# EasyEDA Pro project ZeptoWatch.eprj, schematic Schematic6
Create Date: 2022-12-24; Page Name: P1; Project Name: ZeptoWatch; Schematic Name: Schematic6; Update Date: 2022-12-24; Company: 嘉立创EDA; Page Size: A2; Version: V1.0
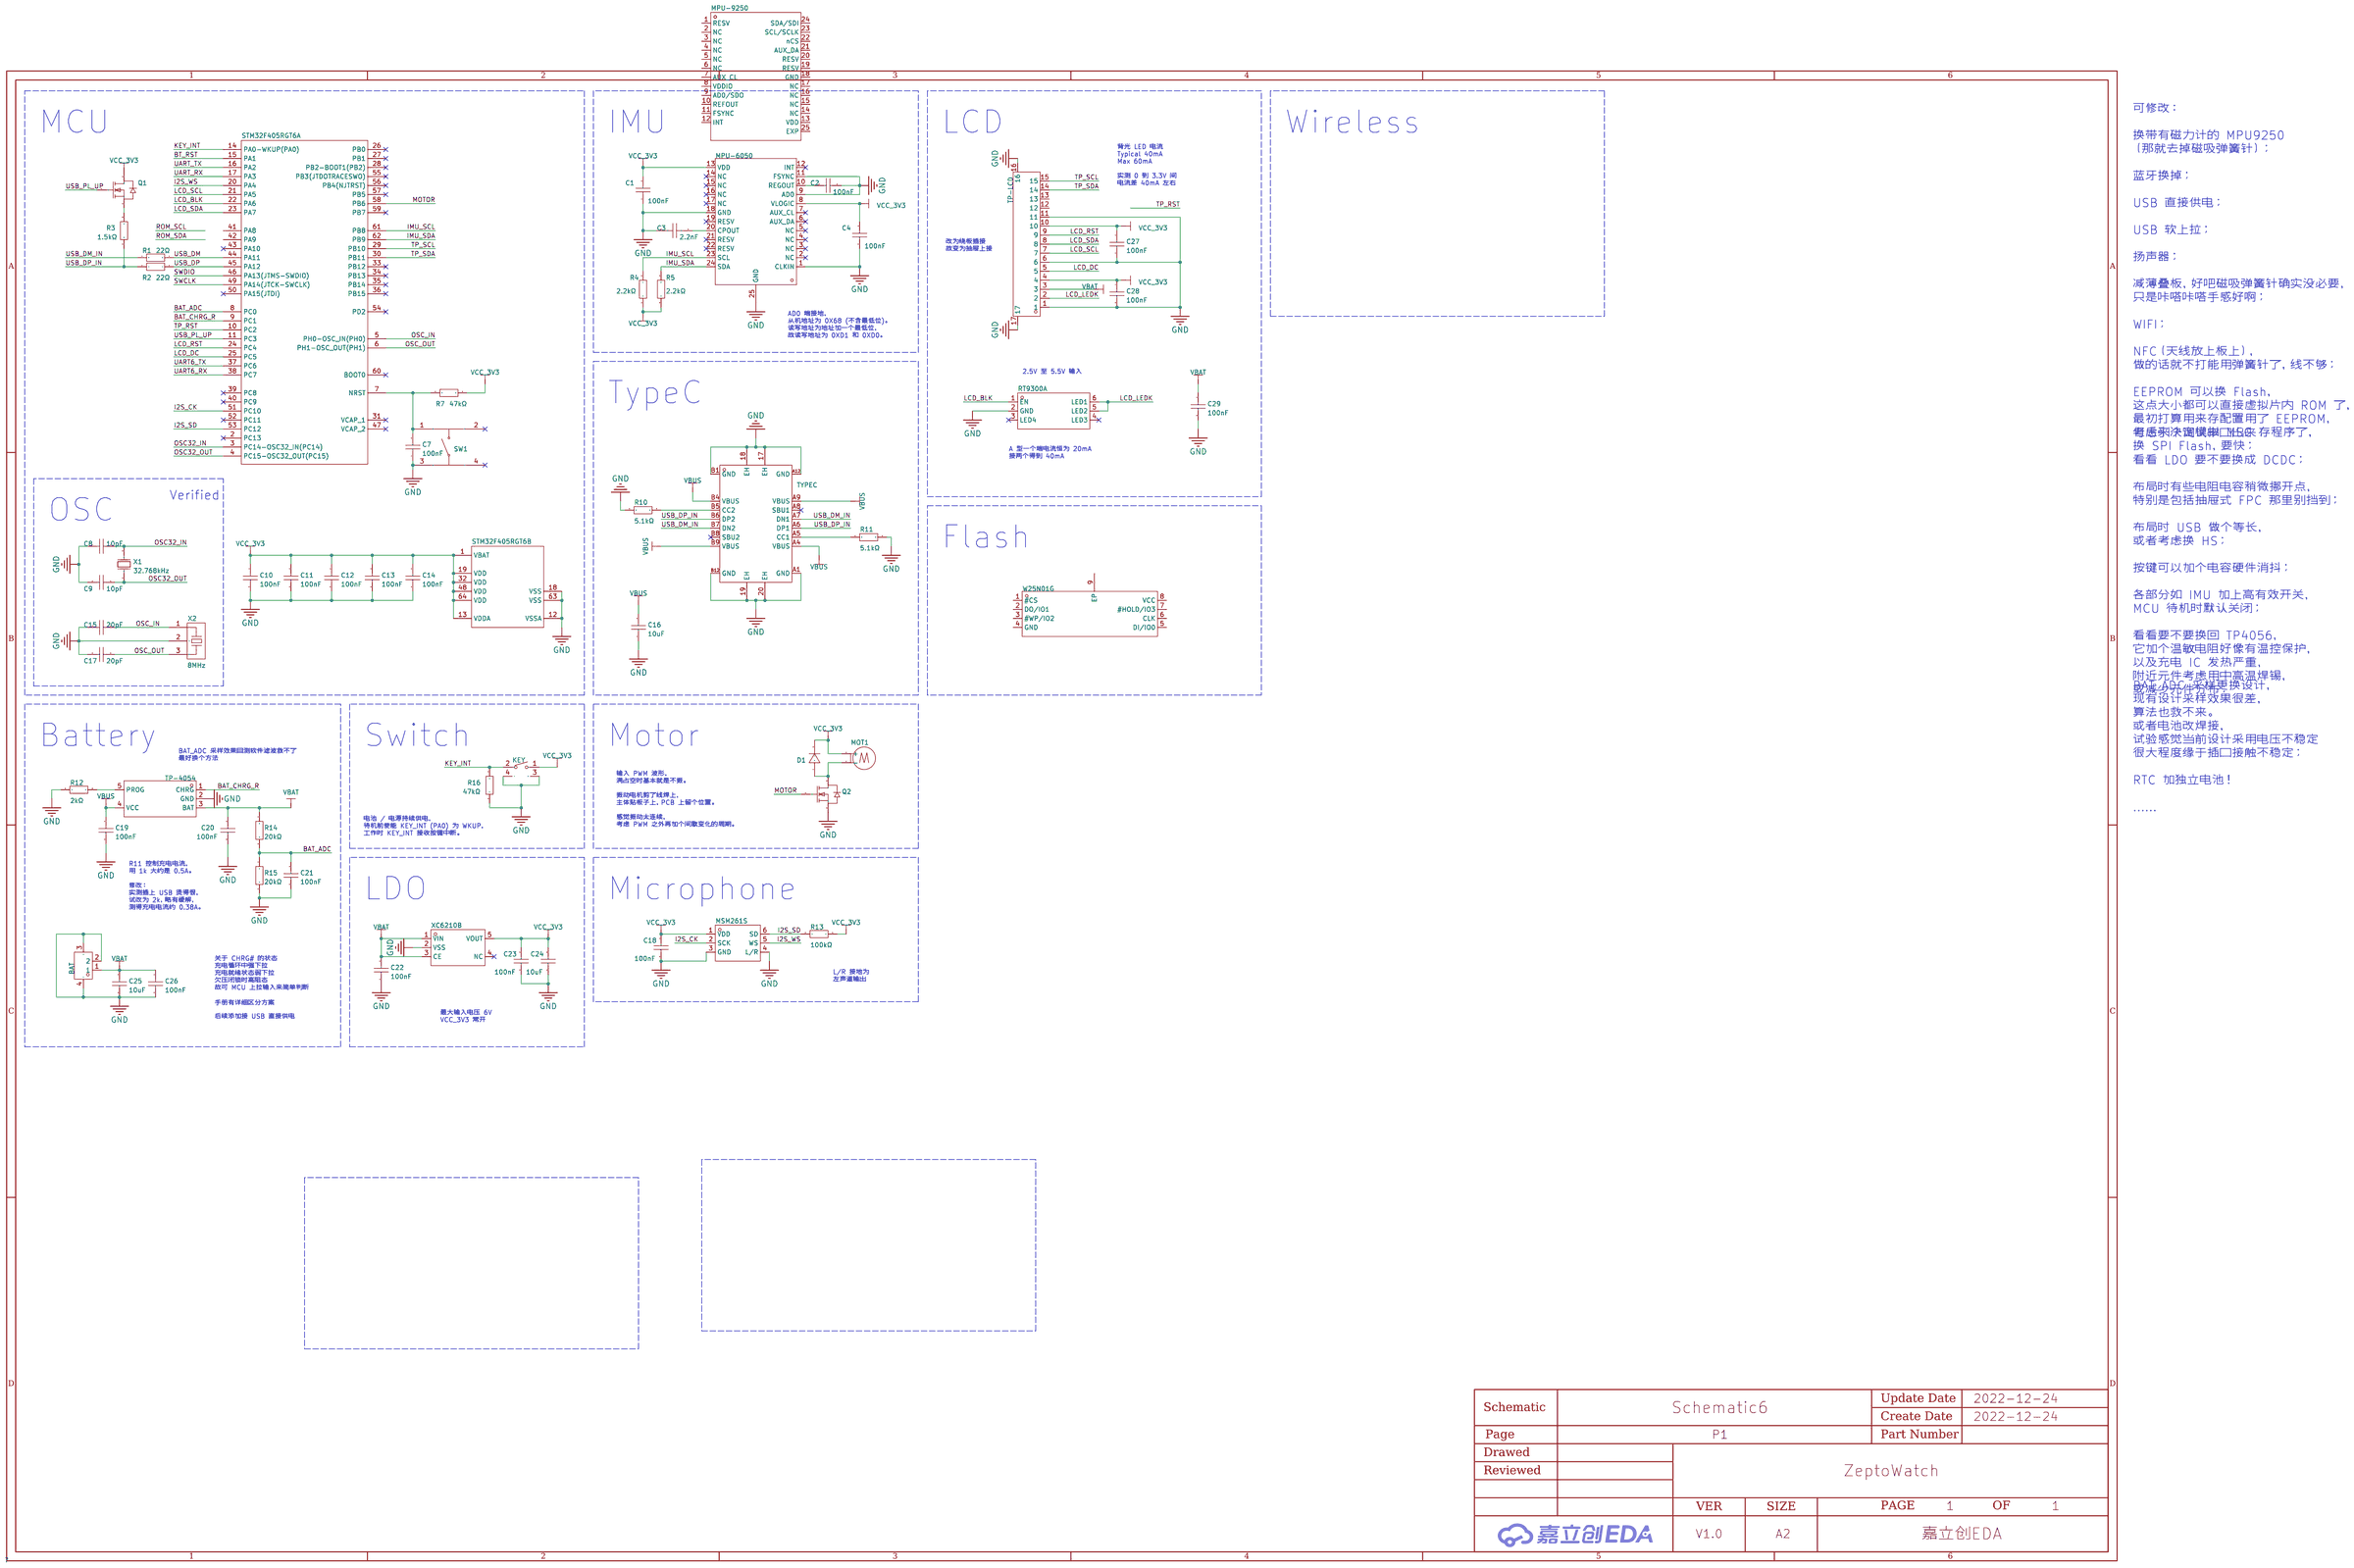
[diagram p5: schematic sheet]

## Parts
BAT  1.25K-CB-2PWB  [CONN-SMD_2P-P1.25_L5.5-W7.7-2PWB]
C1  100nF  [C0402]
C2  100nF  [C0402]
C3  2.2nF  [C0402]
C4  100nF  [C0402]
C7  100nF  [C0402]
C8  10pF  [C0402]
C9  10pF  [C0402]
C10  100nF  [C0402]
C11  100nF  [C0402]
C12  100nF  [C0402]
C13  100nF  [C0402]
C14  100nF  [C0402]
C15  20pF  [C0402]
C16  10uF  [C0402]
C17  20pF  [C0402]
C18  100nF  [C0402]
C19  100nF  [C0402]
C20  100nF  [C0402]
C21  100nF  [C0402]
C22  100nF  [C0402]
C23  100nF  [C0402]
C24  10uF  [C0402]
C25  10uF  [C0402]
C26  100nF  [C0402]
C27  100nF  [C0402]
C28  100nF  [C0402]
C29  100nF  [C0402]
D1  B5819WS  [SOD-323_L1.8-W1.3-LS2.5-FD]
KEY  TS-KG012EV  [SW-SMD_TS-KG012EV]
MOT1  LCM1027A2445F  [VIBRATING-MOTOR-SMD_WELDING]
MPU-6050  MPU-6050  [QFN-24_L4.0-W4.0-P0.50-BL-EP2.7]
MPU-9250  MPU-9250  [QFN-24_L3.0-W3.0-P0.40-BL-EP]
MSM261S  MSM261S3526Z0CM  [MIC-SMD_6P-L3.5-W2.7-P0.90-TR]
Q1  AO3400A  [SOT-23-3_L2.9-W1.6-P1.90-LS2.8-BR]
Q2  AO3400A  [SOT-23-3_L2.9-W1.6-P1.90-LS2.8-BR]
R1  22Ω  [R0402]
R2  22Ω  [R0402]
R3  1.5kΩ  [R0402]
R4  2.2kΩ  [R0402]
R5  2.2kΩ  [R0402]
R7  47kΩ  [R0402]
R10  5.1kΩ  [R0402]
R11  5.1kΩ  [R0402]
R12  2kΩ  [R0402]
R13  100kΩ  [R0402]
R14  20kΩ  [R0402]
R15  20kΩ  [R0402]
R16  47kΩ  [R0402]
RT9300A  -  [SOT-23-6_L2.9-W1.6-P0.95-LS2.8-BR]
STM32F405RGT6  STM32F405RGT6  [LQFP-64_L10.0-W10.0-P0.50-LS12.0-BL]  (sections 1,2)
SW1  TS-1127-C  [SW-SMD_4P-L4.5-W4.5-P3.00-LS6.0]
TP-4054  TP4054-42-SOT25R  [SOT-23-5_L3.0-W1.7-P0.95-LS2.8-BR]
TP-LCD  X05B20U15T  [FFC-SMD_15P-P0.50_X05B20U15T]
TYPEC  TYPE-C-16M-005  [USB-C-SMD_TYPE-C-16M-005]
W25N01G  W25N01GVZEIG  [WSON-8_L8.0-W6.10-P1.27-TL-EP]
X1  32.768kHz  [OSC-SMD_L3.2-W1.5]
X2  8MHz  [OSC-SMD_3P-L3.2-W1.3-P1.2-L]
XC6210B  XC6210B332MR  [SOT-25_L3.0-W1.6-P0.95-LS2.8-BL]

## Library data of the parts
BAT = 1.25K-CB-2PWB: 参考系列:-;间距:1.25mm;插针结构:1x2P;排数:1;每排PIN数:2;行距:-;公母:公型插针;安装方式:卧贴;额定电流:1A;工作温度范围:-25~+85;; LCSC Part Name: 1x2P 间距P=1.25mm 超薄针座 超薄; Supplier Part: C2919570; Manufacturer: HDGC(华德共创); Supplier Footprint: SMD,P=1.25mm; JLCPCB Part Class: 扩展库; Datasheet: https://atta.szlcsc.com/upload/public/pdf/source/20211115/F776F48743F73668B48ED2809AC4027A.pdf; Supplier: LCSC; Pitch: 1.25mm; Pins Structure: 1x2P; Number of Rows: 1; Number of PINs Per Row: 2; Gender: 公型插针; Mounting Style: 卧贴; Current Rating (Max): 1A; Operating Temperature Range: -25~+85
C1 C2 C4 C7 C10-C14 C18-C23 C26-C29 = CC0402KRX7R9BB104: 容值:100nF;精度:±10%;额定电压:50V;材质(温度系数):X7R;; LCSC Part Name: 100nF ±10% 50V; Supplier Part: C131394; Manufacturer: YAGEO(国巨); Supplier Footprint: 0402; JLCPCB Part Class: 扩展库; Datasheet: https://atta.szlcsc.com/upload/public/pdf/source/20170925/C131394_1506321459057990237.pdf; Supplier: LCSC; Tolerance: ±10%; Voltage Rated: 50V; Temperature Coefficient: X7R
C3 = CC0402JRX7R9BB222: 温度系数:X7R;容值:2.2nF;电容体长:-;电容体宽:-;电容体厚度:-;精度:±5%;额定电压:50V;; LCSC Part Name: 2.2nF ±5% 50V; Supplier Part: C513667; Manufacturer: YAGEO(国巨); Supplier Footprint: 0402; JLCPCB Part Class: 扩展库; Datasheet: https://atta.szlcsc.com/upload/public/pdf/source/20200415/C513667_43ACA5E3BCCDD816EC65E9B61132137F.pdf; Supplier: LCSC; Temperature Coefficient: X7R; Tolerance: ±5%; Voltage Rated: 50V
C8 C9 = 0402CG100J500NT: 容值:10pF;精度:±5%;额定电压:50V;材质(温度系数):C0G;; LCSC Part Name: 10pF ±5% 50V; Supplier Part: C1545; Manufacturer: FH(风华); Supplier Footprint: 0402; JLCPCB Part Class: 扩展库; Datasheet: https://atta.szlcsc.com/upload/public/pdf/source/20170923/C1545_1506149264855988352.pdf; Supplier: LCSC; Tolerance: ±5%; Voltage Rated: 50V; Temperature Coefficient: C0G
C15 C17 = 0402CG200J500NT: 温度系数:C0G;容值:20pF;精度:±5%;额定电压:50V;; LCSC Part Name: 20pF(200) ±5% 50V; Supplier Part: C1554; Manufacturer: FH(风华); Supplier Footprint: 0402; JLCPCB Part Class: 基础库; Datasheet: https://atta.szlcsc.com/upload/public/pdf/source/20170923/C1554_1506149268708988361.pdf; Supplier: LCSC; Temperature Coefficient: C0G; Tolerance: ±5%; Voltage Rated: 50V
C16 C24 C25 = CL05A106MQ5NUNC: 容值:10uF;精度:±20%;额定电压:6.3V;材质(温度系数):X5R;; LCSC Part Name: 10uF ±20% 6.3V; Supplier Part: C15525; Manufacturer: SAMSUNG(三星); Supplier Footprint: 0402; JLCPCB Part Class: 基础库; Datasheet: https://atta.szlcsc.com/upload/public/pdf/source/20220823/2B02EE04F8F211D38A52DCB16EB6BEBA.pdf; Supplier: LCSC; Tolerance: ±20%; Voltage Rated: 6.3V; Temperature Coefficient: X5R
D1 = B5819WS_C511873: 直流反向耐压(Vr):40V;平均整流电流(Io):1A;正向压降(Vf):900mV@3A;; LCSC Part Name: 40V 1A 900mV@3A; Supplier Part: C511873; Manufacturer: BORN伯恩半导体; Supplier Footprint: SOD-323; JLCPCB Part Class: 扩展库; Datasheet: https://atta.szlcsc.com/upload/public/pdf/source/20200413/C511871_84C991E4F87F9BC6B00A967897FF2061.pdf; Supplier: LCSC; Reverse Voltage (Vr): 40V; Average Rectified Current (Io): 1A; Forward Voltage (Vf@If): 900mV@3A
KEY = TS-KG012EV: 触点电流:50mA;额定电压(DC):12V;绝缘电阻:100MΩ;电路结构:单刀单掷;安装方式:卧插;按钮形状:矩形按钮;带灯:-;; LCSC Part Name: 轻触开关3*6*3.5侧按卧式 带柱; Supplier Part: C410363; Manufacturer: HANBO(汉博); Supplier Footprint: 插件,7.8x3.6x3.5mm; JLCPCB Part Class: 扩展库; Datasheet: https://atta.szlcsc.com/upload/public/pdf/source/20221110/2C1BC81D53AC7E4C4CC26C5BC87C8C3B.pdf; Supplier: LCSC; Contact Current: 50mA; Voltage Rating (DC): 12V; Insulation Resistance: 100MΩ; Circuit: 单刀单掷; Mounting Style: 卧插; Actuator Style: 矩形按钮
MOT1 = LCM1027A2445F: 类型:扁平振动马达;额定电压:3V;额定电流:80mA;额定转速:10000rpm;工作温度:-20~+60;旋转方向:CW；CCW;; LCSC Part Name: 扁平1027 振动马达; Supplier Part: C2759984; Manufacturer: LEADER(立得); JLCPCB Part Class: 扩展库; Datasheet: https://atta.szlcsc.com/upload/public/pdf/source/20210326/C2759984_5008EC97BD438BDFB6866D31635439F4.pdf; Supplier: LCSC; Type: 扁平振动马达; Rated Voltage: 3V; Rated Current: 80mA; Rated Speed: 10000rpm; Operating Temperature: -20~+60; Sense Of Rotation: CW；CCW
MPU-6050 = MPU-6050: 三轴加速度计和三轴陀螺仪，工作电压：2.375V~3.46V; Supplier Part: C24112; Manufacturer: TDK InvenSense(应美盛); Supplier Footprint: QFN-24_4x4x05P; JLCPCB Part Class: 扩展库; Datasheet: https://atta.szlcsc.com/upload/public/pdf/source/20140425/1457707046159.pdf; Supplier: LCSC
MPU-9250 = MPU-9250: 9轴传感器; LCSC Part Name: MPU-9250 停产; Supplier Part: C71459; Manufacturer: TDK InvenSense(应美盛); Supplier Footprint: QFN-24; JLCPCB Part Class: 扩展库; Datasheet: https://atta.szlcsc.com/upload/public/pdf/source/20170810/C71459_1502335389644879978.pdf; Supplier: LCSC
MSM261S = MSM261S3526Z0CM: Supplier Part: C966933; Manufacturer: MEMS(敏芯微); Supplier Footprint: SMD,3.5x2.65x0.98mm; JLCPCB Part Class: 扩展库; Datasheet: https://atta.szlcsc.com/upload/public/pdf/source/20210104/C966933_3269232C81BB891E12095FC7E88FC637.pdf; Supplier: LCSC
Q1 Q2 = AO3400A_C20917: 类型:N沟道;漏源电压(Vdss):30V;连续漏极电流(Id):5.7A;功率(Pd):1.4W;导通电阻(RDS(on)@Vgs,Id):26.5mΩ@10V,5.7A;阈值电压(Vgs(th)@Id):1.5V@250A;; LCSC Part Name: N沟道 30V 5.7A; Supplier Part: C20917; Manufacturer: AOS; Supplier Footprint: SOT-23-3L; JLCPCB Part Class: 基础库; Datasheet: https://atta.szlcsc.com/upload/public/pdf/source/20140107/1457706668533.pdf; Supplier: LCSC; Type: N沟道; Drain Source Voltage (Vdss): 30V; Continuous Drain Current (Id): 5.7A; Power Dissipation (Pd): 1.4W; Drain Source On Resistance (RDS(on)@Vgs,Id): 26.5mΩ@10V,5.7A; Gate Threshold Voltage (Vgs(th)@Id): 1.5V@250A
R1 R2 = CR0402FF22R0G: 电阻类型:厚膜电阻;阻值:22Ω;精度:±1%;功率:1/16W;温度系数:±200ppm/;最大工作电压:50V;工作温度范围:-55~+125;; LCSC Part Name: 22Ω ±1%; Supplier Part: C100318; Manufacturer: LIZ(丽智电子); Supplier Footprint: 0402; Datasheet: https://atta.szlcsc.com/upload/public/pdf/source/20170408/1491621411980.pdf; Supplier: LCSC; Type: 厚膜电阻; Tolerance: ±1%; Power(Watts): 1/16W; Temperature Coefficient: ±200ppm/; Overload Voltage (Max): 50V; Operating Temperature Range: -55~+125
R3 = 0402WGF1501TCE: 阻值:1.5kΩ;精度:±1%;功率:1/16W;温度系数:±100ppm/;最大工作电压:50V;工作温度范围:-55~+155;; LCSC Part Name: 1.5KΩ ±1%; Supplier Part: C25867; Manufacturer: UNI-ROYAL(厚声); Supplier Footprint: 0402; JLCPCB Part Class: 基础库; Datasheet: https://atta.szlcsc.com/upload/public/pdf/source/20170920/C25867_1505895090394980874.pdf; Supplier: LCSC; Tolerance: ±1%; Power(Watts): 1/16W; Temperature Coefficient: ±100ppm/; Overload Voltage (Max): 50V; Operating Temperature Range: -55~+155
R4 R5 = RMC04022.2K5%N: 阻值:2.2kΩ;精度:±5%;功率:1/16W;; LCSC Part Name: 2.2kΩ ±5%; Supplier Part: C269678; Manufacturer: Tyohm(幸亚电阻); Supplier Footprint: 0402; JLCPCB Part Class: 扩展库; Datasheet: https://atta.szlcsc.com/upload/public/pdf/source/20190115/C269678_CFD168C224D6BF2B41E71AA235945392.pdf; Supplier: LCSC; Tolerance: ±5%; Power(Watts): 1/16W
R7 R16 = 0402WGF4702TCE: 电阻类型:厚膜电阻;阻值:47kΩ;精度:±1%;功率:62.5mW;温度系数:±100ppm/;最大工作电压:50V;工作温度范围:-55~+155;; LCSC Part Name: 47kΩ ±1% 62.5mW; Supplier Part: C25792; Manufacturer: UNI-ROYAL(厚声); Supplier Footprint: 0402; JLCPCB Part Class: 基础库; Datasheet: https://atta.szlcsc.com/upload/public/pdf/source/20200306/C422600_1E6D84923E4A46A82E41ADD87F860B5C.pdf; Supplier: LCSC; Type: 厚膜电阻; Tolerance: ±1%; Power(Watts): 62.5mW; Temperature Coefficient: ±100ppm/; Overload Voltage (Max): 50V; Operating Temperature Range: -55~+155
R10 R11 = RC0402FR-075K1L: 阻值:5.1kΩ;精度:±1%;功率:62.5mW;温度系数:±100ppm/;最大工作电压:50V;工作温度范围:-55~+155;; LCSC Part Name: 5.1kΩ ±1% 62.5mW; Supplier Part: C105872; Manufacturer: YAGEO(国巨); Supplier Footprint: 0402; JLCPCB Part Class: 扩展库; Datasheet: https://atta.szlcsc.com/upload/public/pdf/source/20170912/C105872_1505207464555963229.pdf; Supplier: LCSC; Tolerance: ±1%; Power(Watts): 62.5mW; Temperature Coefficient: ±100ppm/; Overload Voltage (Max): 50V; Operating Temperature Range: -55~+155
R12 = WR04X202JTL: 精度:±5%;阻值:2kΩ;功率:1/16W;温度系数:±100ppm/;最大工作电压:50V;工作温度范围:-55~+155;; LCSC Part Name: 2kΩ ±5%; Supplier Part: C168256; Manufacturer: Walsin(华新科); Supplier Footprint: 0402; JLCPCB Part Class: 扩展库; Datasheet: https://atta.szlcsc.com/upload/public/pdf/source/20180228/C168256_15198055032591377457.pdf; Supplier: LCSC; Tolerance: ±5%; Power(Watts): 1/16W; Temperature Coefficient: ±100ppm/; Overload Voltage (Max): 50V; Operating Temperature Range: -55~+155
R13 = AC0402FR-07100KL: 电阻类型:厚膜电阻;阻值:100kΩ;精度:±1%;功率:62.5mW;温度系数:±100ppm/;最大工作电压:50V;工作温度范围:-55~+155;; LCSC Part Name: 100kΩ ±1%; Supplier Part: C144809; Manufacturer: YAGEO(国巨); Supplier Footprint: 0402; JLCPCB Part Class: 扩展库; Datasheet: https://atta.szlcsc.com/upload/public/pdf/source/20171225/C144809_15141880836601203001.pdf; Supplier: LCSC; Type: 厚膜电阻; Tolerance: ±1%; Power(Watts): 62.5mW; Temperature Coefficient: ±100ppm/; Overload Voltage (Max): 50V; Operating Temperature Range: -55~+155
R14 R15 = RC-02W203JT: 阻值:20kΩ;精度:±5%;功率:62.5mW;温度系数:±200ppm/;最大工作电压:50V;工作温度范围:-55~+155;; LCSC Part Name: 20kΩ ±5% 62.5mW; Supplier Part: C258120; Manufacturer: FH(风华); Supplier Footprint: 0402; JLCPCB Part Class: 扩展库; Datasheet: https://atta.szlcsc.com/upload/public/pdf/source/20180730/C258120_EB2ABA5B79561D80B536831B08AD21D8.pdf; Supplier: LCSC; Tolerance: ±5%; Power(Watts): 62.5mW; Temperature Coefficient: ±200ppm/; Overload Voltage (Max): 50V; Operating Temperature Range: -55~+155
RT9300A = RT9300AGE: 类型:-;拓扑结构:-;内部开关:-;供电电压（最低）:-;供电电压（最高）:-;频率:-;; Supplier Part: C68151; Manufacturer: RICHTEK(台湾立锜); Supplier Footprint: SOT-23-6; JLCPCB Part Class: 扩展库; Datasheet: https://atta.szlcsc.com/upload/public/pdf/source/20180420/C68151_339603FDACFBF870F6D423A94B86B684.pdf; Supplier: LCSC
STM32F405RGT6 = STM32F405RGT6: 主频（MAX):168MHz;工作电压:1.8V ~ 3.6V;; Supplier Part: C15742; Manufacturer: ST(意法半导体); Supplier Footprint: LQFP-64_10x10x05P; JLCPCB Part Class: 扩展库; Datasheet: https://atta.szlcsc.com/upload/public/pdf/source/20140724/1457707160365.pdf; Supplier: LCSC; Speed: 168MHz; Voltage - Supply (Vcc/Vdd): 1.8V ~ 3.6V; Program Memory Size: 1MB; RAM Size: 192KB; Number of I/O: 51; A/D: 16x12bit; D/A: 2x12bit; PWM: 56; LCD: MOTOROLA 6800 AND INTEL  8080 TYPE LCD DIRECTLY; UART/USART: 4 USART+2 UART; SPI: 3; I2C（SMBUS/PMBUS）: 3; USB Device: 1; USB Host/OTG: 1; CAN: 2
SW1 = TS-1127-C: 触点电流:50mA;额定电压(DC):12V;绝缘电阻:100mΩ;电路结构:单刀单掷;安装方式:立贴;按钮形状:圆形按钮;按钮/盖帽颜色:黑色;带灯:无;作用力:260gf;机械寿命:100000;工作温度:-30~+85;开关长度:4.5mm;开关宽度:4.5mm;开关高度:1.5mm;带支架:否;; LCSC Part Name: 4.5x4.5x1.6薄型260gf; Supplier Part: C388640; Manufacturer: XKB Connectivity(中国星坤); Supplier Footprint: SMD; JLCPCB Part Class: 扩展库; Datasheet: https://atta.szlcsc.com/upload/public/pdf/source/20220425/61AC42BD61018C5DB2224B3335A7DB84.pdf; Supplier: LCSC; Contact Current: 50mA; Voltage Rating (DC): 12V; Insulation Resistance: 100mΩ; Circuit: 单刀单掷; Mounting Style: 立贴; Actuator Style: 圆形按钮; Actuator/Cap Color: 黑色; With Lamp: 无; Operating Force: 260gf; Mechanical Life: 100000; Operating Temperature: -30~+85; Switch Length: 4.5mm; Switch Width: 4.5mm; Switch Height: 1.5mm; Strike Gundam: 否
TP-4054 = TP4054-42-SOT25R: 充电电池的类型:-;电池单元组数:-;最大充电电流:-;充满的电池组电压:-;最大供应电压:-;; Supplier Part: C32574; Manufacturer: TOPPOWER(南京拓微); Supplier Footprint: SOT-23-5; JLCPCB Part Class: 基础库; Datasheet: https://atta.szlcsc.com/upload/public/pdf/source/20140621/1457707095588.pdf; Supplier: LCSC
TP-LCD = X05B20U15T: 间距:0.5mm;触点数量:15;锁定特性:抽屉式;安装类型:卧贴;触点类型:上接;工作温度范围:-25~+85;焊接温度(最大值):260;; LCSC Part Name: 0.5mm P数:15 抽屉式 上接 镀锡; Supplier Part: C388701; Manufacturer: XKB Connectivity(中国星坤); Supplier Footprint: SMD,P=0.5mm; JLCPCB Part Class: 扩展库; Datasheet: https://atta.szlcsc.com/upload/public/pdf/source/20211011/8C194F98FD26D55C033D3194A9E7CFC8.pdf; Supplier: LCSC; Pitch: 0.5mm; Number of Contacts: 15; Locking Feature: 抽屉式; Mounting Type: 卧贴; Contact Type: 上接; Height Above Board: 2mm; FFC, FCB Thickness: 0.3mm; Contact Material: 磷青铜; Contact Plating: 锡; Operating Temperature Range: -25~+85; Welding Temperature (Max): 260
TYPEC = TYPE-C-16M-005: 连接器类型:-;标准:-;公母:-;触点数量:-;端口数量:-;安装方式:-;额定电流 - 电源:-;触头材质:-;触头镀层:-;工作温度范围:-;; Supplier Part: C2798173; Manufacturer: USAKRO(美韩); Supplier Footprint: SMD; Datasheet: https://atta.szlcsc.com/upload/public/pdf/source/20210415/C2798173_AFB22F19D04D65557371BF612B0225CF.pdf; Supplier: LCSC
W25N01G = W25N01GVZEIG_C88868: 存储器类型:Non-Volatile;存储器构架(格式):FLASH;存储器容量:1Gb (128M x 8);存储器接口类型:SPI - Dual/Quad I/O;; Supplier Part: C88868; Manufacturer: WINBOND(华邦); Supplier Footprint: WSON-8; JLCPCB Part Class: 扩展库; Datasheet: https://atta.szlcsc.com/upload/public/pdf/source/20180428/C88868_D3C946FD371B1278FED16ED9DB2A4B79.pdf; Supplier: LCSC; Memory Type: Non-Volatile; Memory Format: FLASH; Memory Size: 1Gb (128M x 8); Memory Interface: SPI - Dual/Quad I/O; Voltage - Supply: 2.7V ~ 3.6V
X1 = X1A000141000300: 晶振类型:贴片无源晶振;频率:32.768kHz;频率公差:±20ppm;负载电容:12.5pF;等效串联电阻(ESR):-;工作温度:-40~+85;; LCSC Part Name: 32.768kHz ±20ppm 12.5pF; Supplier Part: C94276; Manufacturer: EPSON(爱普生); Supplier Footprint: SMD3215-2P; JLCPCB Part Class: 扩展库; Datasheet: https://atta.szlcsc.com/upload/public/pdf/source/20190322/C94276_5F77F140A1A8611EFF35496F1E5C1546.pdf; Supplier: LCSC; Crystal Type: 贴片无源晶振; Frequency Tolerance: ±20ppm; Load Capacitance: 12.5pF; Operating Temperature: -40~+85
X2 = CSTCE8M00G15C99-R0: 频率:8MHz;频率容差:±0.1%;内藏负载电容:33pF;谐振阻抗:40Ω;; LCSC Part Name: 8M ±0.1% 33pF; Supplier Part: C110614; Manufacturer: muRata(村田); Supplier Footprint: SMD3213-3P; JLCPCB Part Class: 扩展库; Datasheet: https://atta.szlcsc.com/upload/public/pdf/source/20180327/C110614_9F5031E08ADB10DE4472527BF78A8CAF.pdf; Supplier: LCSC; Frequency Stability: ±0.13%; Frequency Tolerance: ±0.1%; Built-in Load Capacitance: 33pF; Resonant Impedance: 40Ω; Operating Temperature: -40~+125
XC6210B = XC6210B332MR_C424705: 输出类型:固定;输出极性:正;输出通道数:1;最大输入电压:6V;输出电压:3.3V;压差:75mV@(100mA);输出电流:900mA;电源纹波抑制比(PRSS):60dB@(1kHz);; LCSC Part Name: Vin=6V Vout=3.3V 900mA 60dB@(1kHz); Supplier Part: C424705; Manufacturer: TOREX(特瑞仕); Supplier Footprint: SOT-25; JLCPCB Part Class: 扩展库; Datasheet: https://atta.szlcsc.com/upload/public/pdf/source/20190903/C424705_1DFB2113A9A78D399905DBF688657204.pdf; Supplier: LCSC; Output Type: 固定; Output Polarity: 正; Number of Outputs: 1; Maximum Input Voltage: 6V; Output Voltage: 3.3V; Dropout Voltage: 75mV@(100mA); Output Current: 900mA; Power Supply Rejection Ratio (PRSS): 60dB@(1kHz)

## Nets
GND: BAT.2 BAT.3 BAT.4 C1.1 C2.2 C3.2 C4.1 C7.1 C8.1 C9.1 C10.2 C11.2 C12.2 C13.2 C14.1 C15.1 C16.1 C17.1 C18.2 C19.2 C20.2 C21.2 C22.2 C23.2 C24.1 C25.1 C26.2 C27.2 C28.2 C29.2 KEY.3 KEY.4 MPU-6050.1(CLKIN) MPU-6050.9(AD0) MPU-6050.11(FSYNC) MPU-6050.18(GND) MPU-6050.25(GND) MSM261S.3(GND) MSM261S.4(L/R) Q2.2(S) R10.1 R11.2 R12.1 R15.2 R16.1 RT9300A.2(GND) STM32F405RGT6.12(VSSA) STM32F405RGT6.18(VSS) STM32F405RGT6.63(VSS) SW1.3 TP-4054.2(GND) TP-LCD.1 TP-LCD.6 TP-LCD.11 TP-LCD.16 TP-LCD.17 TYPEC.17(EH) TYPEC.18(EH) TYPEC.19(EH) TYPEC.20(EH) TYPEC.A1(GND) TYPEC.A12(GND) TYPEC.B1(GND) TYPEC.B12(GND) X2.2 XC6210B.2(VSS)
VBAT: BAT.1 C20.1 C22.1 C25.2 C26.1 C29.1 R14.1 TP-4054.3(BAT) TP-LCD.3 XC6210B.1(VIN) XC6210B.3(CE)
VBUS: C16.2 C19.1 TP-4054.4(VCC) TYPEC.A4(VBUS) TYPEC.A9(VBUS) TYPEC.B4(VBUS) TYPEC.B9(VBUS)
VCC_3V3: C1.2 C4.2 C10.1 C11.1 C12.1 C13.1 C14.2 C18.1 C23.1 C24.2 C27.1 C28.1 D1.2(K) KEY.1 MOT1.2(+) MPU-6050.8(VLOGIC) MPU-6050.13(VDD) MSM261S.1(VDD) Q1.3(D) R4.1 R5.1 R7.2 R13.1 STM32F405RGT6.1(VBAT) STM32F405RGT6.13(VDDA) STM32F405RGT6.19(VDD) STM32F405RGT6.32(VDD) STM32F405RGT6.48(VDD) STM32F405RGT6.64(VDD) TP-LCD.4 TP-LCD.10 XC6210B.5(VOUT)
BAT_ADC: C21.1 R14.2 R15.1 STM32F405RGT6.8(PC0)
BAT_CHRG_R: STM32F405RGT6.9(PC1) TP-4054.1(CHRG)
BT_RST: STM32F405RGT6.15(PA1)
I2S_CK: MSM261S.2(SCK) STM32F405RGT6.51(PC10)
I2S_SD: MSM261S.6(SD) R13.2 STM32F405RGT6.53(PC12)
I2S_WS: MSM261S.5(WS) STM32F405RGT6.20(PA4)
IMU_SCL: MPU-6050.23(SCL) R4.2 STM32F405RGT6.61(PB8)
IMU_SDA: MPU-6050.24(SDA) R5.2 STM32F405RGT6.62(PB9)
KEY_INT: KEY.2 R16.2 STM32F405RGT6.14(PA0-WKUP(PA0))
LCD_BLK: RT9300A.1(EN) STM32F405RGT6.22(PA6)
LCD_DC: STM32F405RGT6.25(PC5) TP-LCD.5
LCD_LEDK: RT9300A.5(LED2) RT9300A.6(LED1) TP-LCD.2
LCD_RST: STM32F405RGT6.24(PC4) TP-LCD.9
LCD_SCL: STM32F405RGT6.21(PA5) TP-LCD.7
LCD_SDA: STM32F405RGT6.23(PA7) TP-LCD.8
MOTOR: Q2.1(G) STM32F405RGT6.58(PB6)
OSC32_IN: C8.2 STM32F405RGT6.3(PC14-OSC32_IN(PC14)) X1.2(OSC2)
OSC32_OUT: C9.2 STM32F405RGT6.4(PC15-OSC32_OUT(PC15)) X1.1(OSC1)
OSC_IN: C15.2 STM32F405RGT6.5(PH0-OSC_IN(PH0)) X2.1
OSC_OUT: C17.2 STM32F405RGT6.6(PH1-OSC_OUT(PH1)) X2.3
SWCLK: STM32F405RGT6.49(PA14(JTCK-SWCLK))
SWDIO: STM32F405RGT6.46(PA13(JTMS-SWDIO))
TP_RST: STM32F405RGT6.10(PC2)
TP_SCL: STM32F405RGT6.29(PB10) TP-LCD.15
TP_SDA: STM32F405RGT6.30(PB11) TP-LCD.14
UART6_RX: STM32F405RGT6.38(PC7)
UART6_TX: STM32F405RGT6.37(PC6)
UART_RX: STM32F405RGT6.17(PA3)
UART_TX: STM32F405RGT6.16(PA2)
USB_DM: R1.2 STM32F405RGT6.44(PA11)
USB_DM_IN: R1.1 TYPEC.A7(DN1) TYPEC.B7(DN2)
USB_DP: R2.2 STM32F405RGT6.45(PA12)
USB_DP_IN: R2.1 R3.1 TYPEC.A6(DP1) TYPEC.B6(DP2)
USB_PL_UP: Q1.1(G) STM32F405RGT6.11(PC3)
Net-(C2-1): C2.1 MPU-6050.10(REGOUT)
Net-(C3-1): C3.1 MPU-6050.20(CPOUT)
Net-(C7-2): C7.2 R7.1 STM32F405RGT6.7(NRST) SW1.1
Net-(D1-1): D1.1(A) MOT1.1(-) Q2.3(D)
Net-(Q1-2): Q1.2(S) R3.2
Net-(R10-2): R10.2 TYPEC.B5(CC2)
Net-(R11-1): R11.1 TYPEC.A5(CC1)
Net-(R12-2): R12.2 TP-4054.5(PROG)

Not connected (* = marked no-connect by the designer): MPU-6050 2(NC)* 3(NC)* 4(NC)* 5(NC)* 6(AUX_DA)* 7(AUX_CL)* 12(INT)* 14(NC)* 15(NC)* 16(NC)* 17(NC)* 19(RESV)* 21(RESV)* 22(RESV)*; MPU-9250 1(RESV) 2(NC) 3(NC) 4(NC) 5(NC) 6(NC) 7(AUX_CL) 8(VDDIO) 9(AD0/SDO) 10(REFOUT) 11(FSYNC) 12(INT) 13(VDD) 14(NC) 15(NC) 16(NC) 17(NC) 18(GND) 19(RESV) 20(RESV) 21(AUX_DA) 22(nCS) 23(SCL/SCLK) 24(SDA/SDI) 25(EXP); RT9300A 3(LED4)* 4(LED3)*; STM32F405RGT6 2(PC13)* 26(PB0)* 27(PB1)* 28(PB2-BOOT1(PB2))* 31(VCAP_1)* 33(PB12)* 34(PB13)* 35(PB14)* 36(PB15)* 39(PC8)* 40(PC9)* 41(PA8) 42(PA9) 43(PA10)* 47(VCAP_2)* 50(PA15(JTDI))* 52(PC11)* 54(PD2)* 55(PB3(JTDOTRACESWO))* 56(PB4(NJTRST))* 57(PB5)* 59(PB7)* 60(BOOT0)*; SW1 2* 4*; TP-LCD 12 13; TYPEC A8(SBU1)* B8(SBU2)*; W25N01G 1(#CS) 2(DO/IO1) 3(#WP/IO2) 4(GND) 5(DI/IO0) 6(CLK) 7(#HOLD/IO3) 8(VCC) 9(EP); XC6210B 4(NC)*

## Notes on the sheet
- 可修改：
  换带有磁力计的 MPU9250
  （那就去掉磁吸弹簧针）；
  蓝牙换掉；
  USB 直接供电；
  USB 软上拉；
  扬声器；
  减薄叠板，好吧磁吸弹簧针确实没必要，
  只是咔嗒咔嗒手感好啊；
  WIFI；
  NFC（天线放上板上），
  做的话就不打能用弹簧针了，线不够；
  EEPROM 可以换 Flash，
  这点大小都可以直接虚拟片内 ROM 了，
  最初打算用来存配置用了 EEPROM，
  但后来决定模拟 MSC 存程序了，
  换 SPI Flash，要快；
- MCU
- IMU
- LCD
- Wireless
- 背光 LED 电流
  Typical 40mA
  Max 60mA
  实测 0 到 3.3V 间
  电流差 40mA 左右
- 改为绕板插接
  故变为抽屉上接
- AD0 端接地，
  从机地址为 0X68 (不含最低位)。
  读写地址为地址加一个最低位，
  故读写地址为 0XD1 和 0XD0。
- 2.5V 至 5.5V 输入
- TypeC
- 考虑引个调试串口出来；
  看看 LDO 要不要换成 DCDC；
  布局时有些电阻电容稍微挪开点，
  特别是包括抽屉式 FPC 那里别挡到；
  布局时 USB 做个等长，
  或者考虑换 HS；
  按键可以加个电容硬件消抖；
  各部分如 IMU 加上高有效开关，
  MCU 待机时默认关闭；
  看看要不要换回 TP4056，
  它加个温敏电阻好像有温控保护，
  以及充电 IC 发热严重，
  附近元件考虑用中高温焊锡，
  或减少元件分布；
- A 型一个端电流恒为 20mA
  接两个得到 40mA
- Verified
- OSC
- Flash
- BAT_ADC 采样更换设计，
  现有设计采样效果很差，
  算法也救不来。
  或者电池改焊接，
  试验感觉当前设计采用电压不稳定
  很大程度缘于插口接触不稳定；
  RTC 加独立电池！
  ……
- Battery
- BAT_ADC 采样效果目测软件滤波救不了
  最好换个方法
- Switch
- Motor
- 输入 PWM 波形，
  满占空时基本就是不振。
  振动电机剪了线焊上，
  主体贴板子上，PCB 上留个位置。
  感觉振动太连续，
  考虑 PWM 之外再加个间歇变化的周期。
- 电池 / 电源持续供电，
  待机前使能 KEY_INT (PA0) 为 WKUP，
  工作时 KEY_INT 接收按键中断。
- R11 控制充电电流，
  用 1k 大约是 0.5A。
  修改：
  实测插上 USB 烫得很，
  试改为 2k，略有缓解，
  测得充电电流约 0.38A。
- LDO
- Microphone
- 关于 CHRG# 的状态
  充电循环中强下拉
  充电就绪状态弱下拉
  欠压闭锁时高阻态
  故可 MCU 上拉输入来简单判断
- L/R 接地为
  左声道输出
- 手册有详细区分方案
- 后续添加接 USB 直接供电
- 最大输入电压 6V
  VCC_3V3 常开
